# Altium project LeggedBot.PrjPcb
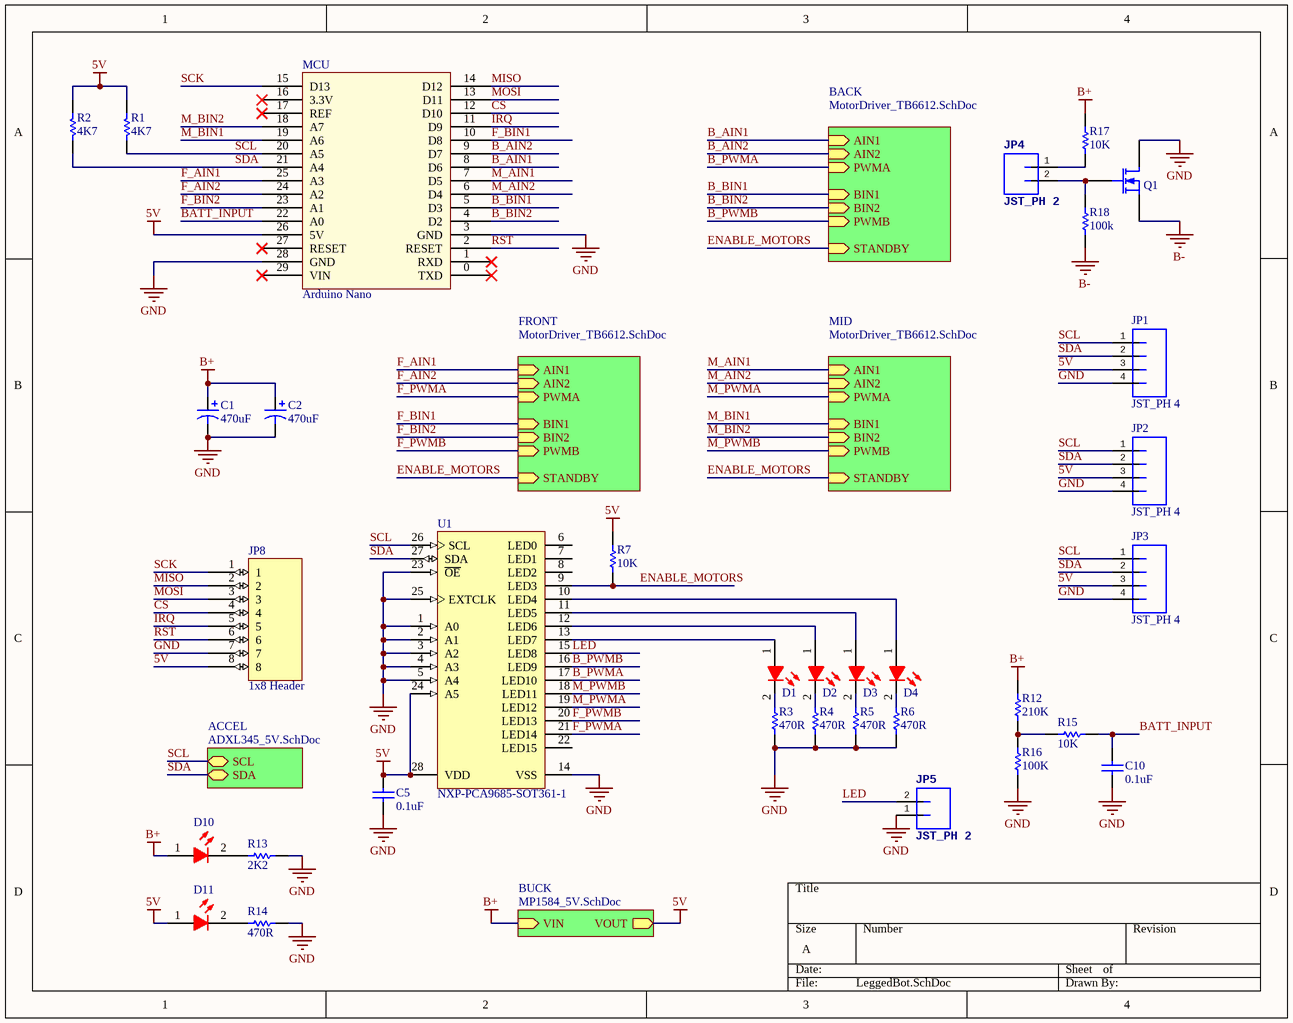
[diagram p0: LeggedBot.SchDoc]
5 sheets, 70 parts. Net scope: hierarchical (ports join the sheet entries above them; power ports are global).
Board file: LeggedBot.PcbDoc
Sheets:
  LeggedBot.SchDoc
    FRONT = MotorDriver_TB6612.SchDoc
    MID = MotorDriver_TB6612.SchDoc
    BACK = MotorDriver_TB6612.SchDoc
    BUCK = MP1584_5V.SchDoc
    ACCEL = ADXL345_5V.SchDoc
      LLS = I2CShifter.SchDoc

## Sheet LeggedBot.SchDoc
size A

### Parts
C1  470uF  [CAP_10mm]
C2  470uF  [CAP_10mm]
C5  0.1uF  [CAPC0603(1608)100_L]
C10  0.1uF  [CAPC0603(1608)100_L]
D1  TLSU1008A(T04)  [TOSH-0603LED_RED_V]  (value not drawn)
D2  TLSU1008A(T04)  [TOSH-0603LED_RED_V]  (value not drawn)
D3  TLSU1008A(T04)  [TOSH-0603LED_RED_V]  (value not drawn)
D4  TLSU1008A(T04)  [TOSH-0603LED_RED_V]  (value not drawn)
D10  TLSU1008A(T04)  [TOSH-0603LED_RED_V]  (value not drawn)
D11  TLSU1008A(T04)  [TOSH-0603LED_RED_V]  (value not drawn)
JP1  JST_PH 4  [JST-4-PTH-VERT]
JP2  JST_PH 4  [JST-4-PTH-VERT]
JP3  JST_PH 4  [JST-4-PTH-VERT]
JP4  JST_PH 2  [JST-2-PTH-VERT]
JP5  JST_PH 2  [JST-2-PTH-VERT]
JP8  1x8 Header  [Header 8x1 8.5mm]
MCU  Arduino Nano  [Arduino Nano]
Q1  MOSFET-N  [SOIC127P600X175-8N]  (value not drawn)
R1  4K7  [RESC0603(1608)_L]
R2  4K7  [RESC0603(1608)_L]
R3  470R  [RESC0603(1608)_L]
R4  470R  [RESC0603(1608)_L]
R5  470R  [RESC0603(1608)_L]
R6  470R  [RESC0603(1608)_L]
R7  10K  [RESC0603(1608)_L]
R12  210K  [RESC0603(1608)_L]
R13  2K2  [RESC0603(1608)_L]
R14  470R  [RESC0603(1608)_L]
R15  10K  [RESC0603(1608)_L]
R16  100K  [RESC0603(1608)_L]
R17  10K  [RESC0603(1608)_L]
R18  100k  [RESC0603(1608)_L]
U1  NXP-PCA9685-SOT361-1  [TSSOP-28]

### Sub-sheets
ACCEL = ADXL345_5V.SchDoc: SDA, SCL (bidir)
BACK = MotorDriver_TB6612.SchDoc: AIN2 (in), PWMA (in), AIN1 (in), BIN1 (in), BIN2 (in), PWMB (in), STANDBY (in)
BUCK = MP1584_5V.SchDoc: VIN (in), VOUT (out)
FRONT = MotorDriver_TB6612.SchDoc: AIN2 (in), PWMA (in), AIN1 (in), BIN1 (in), BIN2 (in), PWMB (in), STANDBY (in)
MID = MotorDriver_TB6612.SchDoc: AIN2 (in), PWMA (in), AIN1 (in), BIN1 (in), BIN2 (in), PWMB (in), STANDBY (in)

### Nets
5V: C5.2 D11.1(A) JP1.3 JP2.3 JP3.3 JP8.8 MCU.26(5V) R1.2 R2.2 R7.2 U1.24(A5) U1.28(VDD) ; sheet BUCK/VOUT
B+: C1.0 C2.0 D10.1(A) R12.2 R17.2 ; sheet BUCK/VIN
B-: Q1.3(S) R18.1
GND: C1.1 C2.1 C5.1 C10.1 JP1.4 JP2.4 JP3.4 JP5.1 JP8.7 MCU.3(GND) MCU.28(GND) Q1.2(D) R3.1 R4.1 R5.1 R6.1 R13.2 R14.1 R16.1 U1.1(A0) U1.2(A1) U1.3(A2) U1.4(A3) U1.5(A4) U1.14(VSS) U1.23(~{OE}) U1.25(EXTCLK)
B_AIN1: MCU.8(D6) ; sheet BACK/AIN1
B_AIN2: MCU.9(D7) ; sheet BACK/AIN2
B_BIN1: MCU.5(D3) ; sheet BACK/BIN1
B_BIN2: MCU.4(D2) ; sheet BACK/BIN2
B_PWMA: U1.17(LED10) ; sheet BACK/PWMA
B_PWMB: U1.16(LED9) ; sheet BACK/PWMB
BATT_INPUT: C10.2 MCU.22(A0) R15.1
CS: JP8.4 MCU.12(D10)
ENABLE_MOTORS: R7.1 U1.9(LED3) ; sheet FRONT/STANDBY, sheet MID/STANDBY, sheet BACK/STANDBY
F_AIN1: MCU.25(A3) ; sheet FRONT/AIN1
F_AIN2: MCU.24(A2) ; sheet FRONT/AIN2
F_BIN1: MCU.10(D8) ; sheet FRONT/BIN1
F_BIN2: MCU.23(A1) ; sheet FRONT/BIN2
F_PWMA: U1.21(LED14) ; sheet FRONT/PWMA
F_PWMB: U1.20(LED13) ; sheet FRONT/PWMB
IRQ: JP8.5 MCU.11(D9)
LED: JP5.2 U1.15(LED8)
M_AIN1: MCU.7(D5) ; sheet MID/AIN1
M_AIN2: MCU.6(D4) ; sheet MID/AIN2
M_BIN1: MCU.19(A6) ; sheet MID/BIN1
M_BIN2: MCU.18(A7) ; sheet MID/BIN2
M_PWMA: U1.19(LED12) ; sheet MID/PWMA
M_PWMB: U1.18(LED11) ; sheet MID/PWMB
MISO: JP8.2 MCU.14(D12)
MOSI: JP8.3 MCU.13(D11)
RST: JP8.6 MCU.2(RESET)
SCK: JP8.1 MCU.15(D13)
SCL: JP1.1 JP2.1 JP3.1 MCU.20(A5) R1.1 U1.26(SCL) ; sheet ACCEL/SCL
SDA: JP1.2 JP2.2 JP3.2 MCU.21(A4) R2.1 U1.27(SDA) ; sheet ACCEL/SDA
NetD1_1: D1.1(A) U1.13(LED7)
NetD1_2: D1.2(K) R3.2
NetD2_1: D2.1(A) U1.12(LED6)
NetD2_2: D2.2(K) R4.2
NetD3_1: D3.1(A) U1.11(LED5)
NetD3_2: D3.2(K) R5.2
NetD4_1: D4.1(A) U1.10(LED4)
NetD4_2: D4.2(K) R6.2
NetD10_2: D10.2(K) R13.1
NetD11_2: D11.2(K) R14.2
NetJP4_1: JP4.1 R17.1
NetJP4_2: JP4.2 Q1.1(G) R18.2
NetR12_1: R12.1 R15.2 R16.2

Not connected (* = marked no-connect by the designer): MCU 0(TXD)* 1(RXD)* 16(3.3V)* 17(REF)* 27(RESET)* 29(VIN)*; U1 6(LED0) 7(LED1) 8(LED2) 22(LED15)

### Library data of the parts
C1 C2 = CAP_10MM_GENERIC: Generic electrolytic capacitor w/ 10mm diameter and 5mm pitch
C5 C10 = CMP-1035-02591-1: CAP 100nF 50V ±5% 0603 (1608 Metric) Thickness 1mm SMD; Tolerance: Â±5%; Case-Metric: 1608; Case-EIA: 0603; Rated Voltage: 50 V; Max Thickness: 1 mm; Technology: SMT; Value: 100nF
D1-D4 D10 D11 = CMP-0444-00001-1: LED, Red 0603 (1608) 63mCd; Manufacturer: Toshiba; Forward Current: 25 mA; Power Dissipation: 60 mW; Packing Type: Reel; Reverse Voltage: 4 V; Mounting Technology: Surface Mount; PackageDescription: 2-Pin SMT LED, 1.6 x 0.8 mm Pitch; ComponentLink1URL: http://www.toshiba-components.com/; ComponentLink1Description: Manufacturer URL; PackageReference: 0603LED_RED; PartNumber: TLSU1008A(T04); ComponentLink2URL: http://www.semicon.toshiba.co.jp/info/docget.jsp?type=datasheet&lang=en&pid=TLSU1008A(T04); ComponentLink2Description: Datasheet; DatasheetVersion: Aug-08; Storage Temperature: -40 to 100 degC
Q1 = MOSFET-N: N-Channel MOSFET; pin to pad: 1>2 2>3 3>1; Published: 8-Jun-2000; LatestRevisionDate: 17-Jul-2002; LatestRevisionNote: Re-released for DXP Platform.; PackageVersion: 1995/1996; PackageReference: E3; Publisher: Altium Limited; PackageDescription: TO, Flat Index; 3 In-Line, Axial Leads; Body Dia. 4.6mm; Lead Dia. 0.5 mm (max)
R1 R2 = CMP-1012-00090-1: 4K7 0.1W 5% 0603 (1608 Metric)  SMD; Case-Metric: 1608; Value: 4700.00 Ohm; Case-EIA: 0603; Tolerance: 5 %; Technology: SMT; Power: 0.1 W
R3-R6 R14 = CMP-1012-00066-1: 470R 0.1W 5% 0603 (1608 Metric)  SMD; Case-Metric: 1608; Case-EIA: 0603; Value: 470.00 Ohm; Tolerance: 5 %; Technology: SMT; Power: 0.1 W
R7 R15 R17 = CMP-1012-00098-1: 10K 0.1W 5% 0603 (1608 Metric)  SMD; Case-EIA: 0603; Value: 10000.00 Ohm; Case-Metric: 1608; Technology: SMT; Tolerance: 5 %; Power: 0.1 W
R12 = CMP-1012-00770-1: 210K 0.1W 1% 0603 (1608 Metric)  SMD; Case-Metric: 1608; Value: 210000.00 Ohm; Case-EIA: 0603; Technology: SMT; Power: 0.1 W; Tolerance: 1 %
R13 = CMP-1012-00082-1: 2K2 0.1W 5% 0603 (1608 Metric)  SMD; Case-Metric: 1608; Value: 2200.00 Ohm; Case-EIA: 0603; Power: 0.1 W; Tolerance: 5 %; Technology: SMT
R16 R18 = CMP-1012-00736-1: 100K 0.1W 1% 0603 (1608 Metric)  SMD; Value: 100000.00 Ohm; Case-Metric: 1608; Case-EIA: 0603; Power: 0.1 W; Tolerance: 1 %; Technology: SMT
JP8 = 1x8 Header: Supplier 1: Arrow; Supplier 2: Arrow; Supplier 3: Digi-Key

## Sheet MotorDriver_TB6612.SchDoc
size A
Used 3 times, as channels FRONT, MID, BACK. Parts and nets are listed once, with the designators drawn on the sheet.
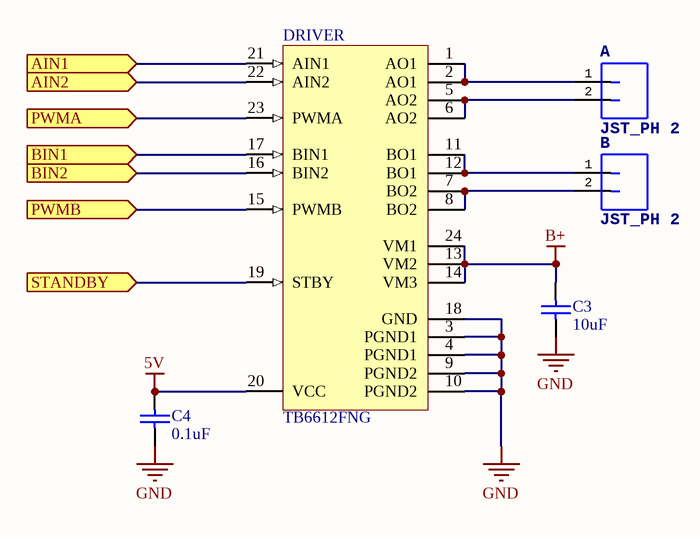
[diagram p1: MotorDriver_TB6612.SchDoc]

### Parts
A  JST_PH 2  [JST-2-PTH-VERT]
B  JST_PH 2  [JST-2-PTH-VERT]
C3  10uF  [CAPC1210(3225)155_N]
C4  0.1uF  [CAPC0603(1608)100_L]
DRIVER  TB6612FNG  [TOSH-SSOP-24_M]

### Ports
AIN1 (in), AIN2 (in), BIN1 (in), BIN2 (in), PWMA (in), PWMB (in), STANDBY (in)

### Nets
5V: C4.2 DRIVER.20(VCC)
B+: C3.2 DRIVER.13(VM2) DRIVER.14(VM3) DRIVER.24(VM1)
GND: C3.1 C4.1 DRIVER.3(PGND1) DRIVER.4(PGND1) DRIVER.9(PGND2) DRIVER.10(PGND2) DRIVER.18(GND)
AIN1: DRIVER.21(AIN1) ; port AIN1
AIN2: DRIVER.22(AIN2) ; port AIN2
BIN1: DRIVER.17(BIN1) ; port BIN1
BIN2: DRIVER.16(BIN2) ; port BIN2
PWMA: DRIVER.23(PWMA) ; port PWMA
PWMB: DRIVER.15(PWMB) ; port PWMB
STANDBY: DRIVER.19(STBY) ; port STANDBY
NetA_1: A.1 DRIVER.1(AO1) DRIVER.2(AO1)
NetA_2: A.2 DRIVER.5(AO2) DRIVER.6(AO2)
NetB_1: B.1 DRIVER.11(BO1) DRIVER.12(BO1)
NetB_2: B.2 DRIVER.7(BO2) DRIVER.8(BO2)

### Channels
FRONT: designators end in _FRONT; ports AIN1=F_AIN1 AIN2=F_AIN2 BIN1=F_BIN1 BIN2=F_BIN2 PWMA=F_PWMA PWMB=F_PWMB STANDBY=ENABLE_MOTORS
MID: designators end in _MID; ports AIN1=M_AIN1 AIN2=M_AIN2 BIN1=M_BIN1 BIN2=M_BIN2 PWMA=M_PWMA PWMB=M_PWMB STANDBY=ENABLE_MOTORS
BACK: designators end in _BACK; ports AIN1=B_AIN1 AIN2=B_AIN2 BIN1=B_BIN1 BIN2=B_BIN2 PWMA=B_PWMA PWMB=B_PWMB STANDBY=ENABLE_MOTORS

### Library data of the parts
C3 = CMP-1038-02231-1: CAP 10uF 25V -20% to +80% 1210 (3225 Metric) Thickness 1.45mm SMD; Case-Metric: 3225; Case-EIA: 1210; Technology: SMT; Value: 10uF; Rated Voltage: 25 V; Max Thickness: 1.45 mm; Tolerance: -20% to +80%
C4 = CMP-1035-02591-1: as C5 on sheet LeggedBot; Rated Voltage: 50 V; Max Thickness: 1 mm; Technology: SMT; Value: 100nF
DRIVER = CMP-1773-00001-1: Driver IC for Dual DC Motor, 15 V, -20 to 85 degC, 24-Pin SSOP, RoHS, Tape and Reel; Elements: 2; Max Power Dissipation: 200 mW; Max Surge Current: 100 mA; Element Configuration: Common Cathode; Case\Package: TO-236-3; Forward Voltage: 1 V; Peak Reverse Current: 0.1 uA; Forward Current: 70 mA; Recovery Time: 5 ns; Radiation Hardening: No; Packaging: Tape and Reel; ComponentLink2Description: Datasheet; REACH SVHC: No SVHC; ComponentLink2URL: https://toshiba.semicon-storage.com/info/docget.jsp?did=10660&prodName=TB6612FNG; RoHSCompliant: true; DatasheetVersion: Oct-14; PackageDescription: 24-Pin Shrink Small Outline Package Integrated Circuit, Body 7.8 x 5.6 mm, Pitch 0.65 mm; Package Quantity: 3000; Length: 3 mm; Pins: 3; Mount: Surface Mount; ComponentLink1Description: Manufacturer URL; PackageReference: SSOP-24; ComponentLink1URL: http://www.toshiba.com/; Width: 1.4 mm; Max Operating Temperature: 125 degC; Height: 1.1 mm; Min Operating Temperature: -55 degC

## Sheet MP1584_5V.SchDoc
size A
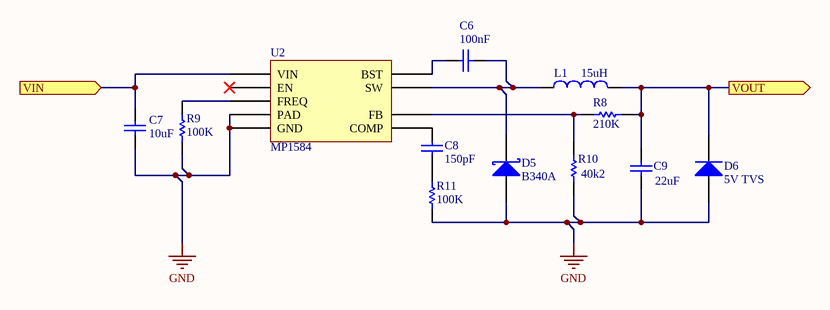
[diagram p2: MP1584_5V.SchDoc]

### Parts
C6  100nF  [CAPC0603(1608)100_L]
C7  10uF  [CAPC1210(3225)280_L]
C8  150pF  [CAPC0603(1608)100_L]
C9  22uF  [CAPC1210(3225)170_L]
D5  B340A  [DIOD-SMA-2_V]
D6  5V TVS  [VISH-DO-214AC-2_L]
L1  value 15uH  [0630 Inductor]  (hidden comment: 0630 Inductor)
R8  210K  [RESC0603(1608)_L]
R9  100K  [RESC0603(1608)_L]
R10  40k2  [RESC0603(1608)_L]
R11  100K  [RESC0603(1608)_L]
U2  MP1584  [SOIC8E]

### Ports
VIN (in), VOUT (out)

### Nets
5V: C9.2 D6.1(K) L1.2 R8.2 ; port VOUT
B+: C7.2 U2.7(VIN) ; port VIN
GND: C7.1 C9.1 D5.1(A) D6.2(A) R9.1 R10.1 R11.1 U2.5(GND) U2.9(PAD)
NetC6_1: C6.1 U2.8(BST)
NetC6_2: C6.2 D5.2(K) L1.1 U2.1(SW)
NetC8_1: C8.1 R11.2
NetC8_2: C8.2 U2.3(COMP)
NetR8_1: R8.1 R10.2 U2.4(FB)
NetR9_2: R9.2 U2.6(FREQ)

Not connected (* = marked no-connect by the designer): U2 2(EN)*

### Library data of the parts
C6 = CMP-1035-02591-1: as C5 on sheet LeggedBot; Rated Voltage: 50 V; Max Thickness: 1 mm; Technology: SMT; Value: 100nF
C7 = CMP-1038-02234-1: CAP 10uF 35V ±10% 1210 (3225 Metric) Thickness 2.8mm SMD; Case-Metric: 3225; Case-EIA: 1210; Tolerance: Â±10%; Rated Voltage: 35 V; Value: 10uF; Max Thickness: 2.8 mm; Technology: SMT
C8 = CMP-1035-01367-1: CAP 150pF 50V ±5% 0603 (1608 Metric) Thickness 1mm SMD; Case-Metric: 1608; Tolerance: Â±5%; Case-EIA: 0603; Technology: SMT; Rated Voltage: 50 V; Value: 150pF; Max Thickness: 1 mm
C9 = CMP-1038-02258-1: CAP 22uF 6.3V ±10% 1210 (3225 Metric) Thickness 1.7mm SMD; Case-Metric: 3225; Tolerance: Â±10%; Case-EIA: 1210; Value: 22uF; Rated Voltage: 6.3 V; Technology: SMT; Max Thickness: 1.7 mm
D5 = CMP-1667-00003-1: Surface Mount Schottky Barrier Rectifier, 40 V, 3 A, -55 to 150 degC, 2-Pin SMA, RoHS, Tape and Reel; Forward Current: 3 A; Forward Voltage: 500 mV; Max Surge Current: 80 A; Peak Reverse Current: 500 uA; Elements: 1; Mounting Technology: Surface Mount; ComponentLink1URL: http://www.diodes.com/; PackageDescription: 2-Pin Surface Mounted Assembly, Body 4.3 x 2.605 mm, Height 2.4 mm; Min Operating Temperature: -55 degC; Mount: Surface Mount; Pins: 2; ComponentLink2URL: http://www.diodes.com/_files/datasheets/ds30891.pdf; PackageReference: SMA-2; Max Operating Temperature: 125 degC; Radiation Hardening: No; Length: 4.6 mm; RoHSCompliant: true; ComponentLink1Description: Manufacturer URL; Height: 2.1 mm; ComponentLink2Description: Datasheet; Packaging: Tape and Reel; Package Quantity: 5000; Case\Package: SMA; DatasheetVersion: Rev. 17 - 2, 09/2015; REACH SVHC: No SVHC; Width: 2.92 mm
D6 = CMP-0548-00062-2: Transient Voltage Suppressor, 6.40 to 231 V, 5 V Stand-off Voltage, Uni-Directional, -55 to 155 degC, 2-pin DO-214AC, Pb-Free, Tape and Reel; Manufacturer: Vishay Semiconductor; PartNumber: SMAJ5.0AHE3/61; ID (uA): 800; VBR Uni-Directional (V): 6.4 to 231; IFSM: 40 A; VWM (V): 5; PPPM (W): 400, 300; DatasheetVersion: 12/8/2013; ComponentLink3URL: http://www.vishay.com/docs/88390/smaj50a.pdf; ComponentLink2URL: http://www.vishay.com/docs/88390/smaj50a.pdf; PackageDescription: 2-Pin DO-214AC (SMA), Body 4.245 x 2.665 mm; ComponentLink3Description: Package Specification; RoHS: TRUE; Operating Junction and Storage Temperature Range: -55 to 150 degC; ComponentLink2Description: Datasheet; Mounting Technology: Surface Mount; Packing: Tape and Reel; PackageReference: DO-214AC-2; ComponentLink1Description: Manufacturer URL; ComponentLink1URL: http://www.vishay.com/
L1 = PCC-M0630M: Code_IEC: 1005; Published: 8-Jun-2000; LatestRevisionDate: 29-May-2009; LatestRevisionNote: IPC-7351 Footprint Added.; PackageReference: 0402-A; Publisher: Altium Limited; PackageDescription: Chip Inductor; Code_JEITA: 0402
R8 = CMP-1012-00770-1: as R12 on sheet LeggedBot; Technology: SMT; Power: 0.1 W; Tolerance: 1 %
R9 R11 = CMP-1012-00122-1: 100K 0.1W 5% 0603 (1608 Metric)  SMD; Case-EIA: 0603; Value: 100000.00 Ohm; Case-Metric: 1608; Tolerance: 5 %; Power: 0.1 W; Technology: SMT
R10 = CMP-1012-00691-1: 40K2 0.1W 1% 0603 (1608 Metric)  SMD; Case-Metric: 1608; Value: 40200.00 Ohm; Case-EIA: 0603; Tolerance: 1 %; Technology: SMT; Power: 0.1 W
U2 = MP1584: MP1584 3A, 1.5MHz, 28V Step-Down Converter

## Sheet ADXL345_5V.SchDoc
size A
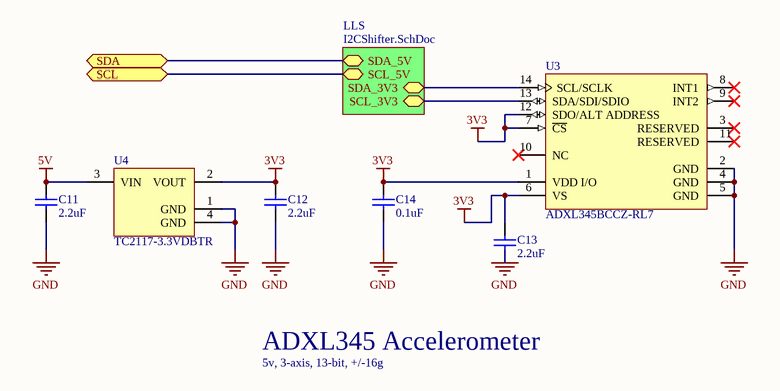
[diagram p3: ADXL345_5V.SchDoc]

### Parts
C11  2.2uF  [CAPC0603(1608)100_L]
C12  2.2uF  [CAPC0603(1608)100_L]
C13  2.2uF  [CAPC0603(1608)100_L]
C14  0.1uF  [CAPC0603(1608)100_L]
U3  ADXL345BCCZ-RL7  [ADI-CC-14-1_V]
U4  TC2117-3.3VDBTR  [SOT-223-DB3_L]

### Sub-sheets
LLS = I2CShifter.SchDoc: SDA_3V3 (bidir), SCL_3V3 (bidir), SDA_5V (bidir), SCL_5V (bidir)

### Ports
SCL (bidir), SDA

### Nets
3V3: C12.2 C13.2 C14.2 U3.1(VDD_I/O) U3.6(VS) U3.7(~{CS}) U3.12(SDO/ALT_ADDRESS) U4.2(VOUT)
5V: C11.2 U4.3(VIN)
GND: C11.1 C12.1 C13.1 C14.1 U3.2(GND) U3.4(GND) U3.5(GND) U4.1(GND) U4.4(GND)
SCL: port SCL, sheet LLS/SCL_5V
SDA: port SDA, sheet LLS/SDA_5V
NetQ2_2: U3.14(SCL/SCLK) ; sheet LLS/SDA_3V3
NetQ3_2: U3.13(SDA/SDI/SDIO) ; sheet LLS/SCL_3V3

Not connected (* = marked no-connect by the designer): U3 3(RESERVED)* 8(INT1)* 9(INT2)* 10(NC)* 11(RESERVED)*

### Notes on the sheet
- ADXL345 Accelerometer
- 5v, 3-axis, 13-bit, +/-16g

### Library data of the parts
C11-C13 = CMP-1035-02767-1: CAP 2.2uF 25V ±10% 0603 (1608 Metric) Thickness 1mm SMD; Case-EIA: 0603; Tolerance: Â±10%; Case-Metric: 1608; Technology: SMT; Value: 2.2uF; Max Thickness: 1 mm; Rated Voltage: 25 V
C14 = CMP-1035-02591-1: as C5 on sheet LeggedBot; Rated Voltage: 50 V; Max Thickness: 1 mm; Technology: SMT; Value: 100nF
U3 = CMP-0885-00033-1: 3-Axis, +/-2 g / +/-4 g / +/-8 g / +/-16 g Digital Accelerometer with Digital Output, 1.6 KHz BW, Industrial, 14-pin LGA, Reel; Manufacturer: Analog Devices; Supply Current: 140 uA; Voltage Supply (V): 2.0 to 3.6; -3dB Bandwidth: 1.6 KHz; Sensitivity: 256/128/64/32 LSB/g; # of Axes: 3; Output Type: Digital; PackageDescription: 14-Pin Land Grid Array, 3 x 5 mm Body, 0.8 mm Pitch; ComponentLink1URL: http://www.analog.com/en/index.html; ComponentLink2Description: Datasheet; PartNumber: ADXL345BCCZ-RL7; ComponentLink3Description: Package Specification; ComponentLink4URL: http://www.analog.com/en/mems-sensors/mems-inertial-sensors/adxl345/products/product.html; PackageVersion: 03-16-2010-A, 03/2010; ComponentLink1Description: Manufacturer URL; ComponentLink2URL: http://www.analog.com/static/imported-files/data_sheets/ADXL345.pdf; DatasheetVersion: Rev. D; PackageReference: CC-14-1; Packing: Reel; Mounting Technology: Surface Mount; ComponentLink4Description: Product URL; ComponentLink3URL: http://www.analog.com/static/imported-files/data_sheets/ADXL343.pdf
U4 = CMP-0136-00509-1: 800 mA Fixed Low Dropout Positive Regulator, 3-Pin SOT-223, Extended Temperature, Tape and Reel; PackageVersion: revBB, Aug-2009; DatasheetVersion: revC, Oct-2006; PackageReference: SOT-223-DB3; PackageDescription: 3-Lead Plastic Small Outline Transistor (DB) [SOT-223]

## Sheet I2CShifter.SchDoc
size A
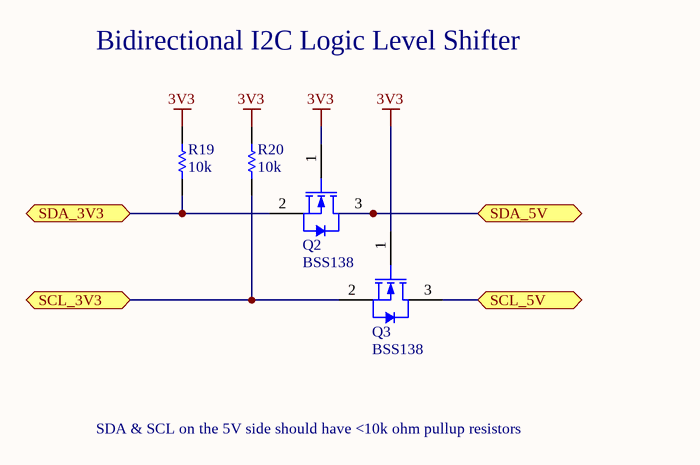
[diagram p4: I2CShifter.SchDoc]

### Parts
Q2  BSS138  [FAIR-SOT23-3_V]
Q3  BSS138  [FAIR-SOT23-3_V]
R19  10k  [RESC0603(1608)_L]
R20  10k  [RESC0603(1608)_L]

### Ports
SCL_3V3 (bidir), SCL_5V (bidir), SDA_3V3 (bidir), SDA_5V (bidir)

### Nets
3V3: Q2.1(G) Q3.1(G) R19.2 R20.2
SCL: Q3.3(D) ; port SCL_5V
SDA: Q2.3(D) ; port SDA_5V
NetQ2_2: Q2.2(S) R19.1 ; port SDA_3V3
NetQ3_2: Q3.2(S) R20.1 ; port SCL_3V3

### Notes on the sheet
- Bidirectional I2C Logic Level Shifter
- SDA & SCL on the 5V side should have <10k ohm pullup resistors

### Library data of the parts
Q2 Q3 = CMP-1670-00009-1: N-Channel Logic Level Enhancement Mode Field Effect Transistor, 220 mA, 50 V, -55 to 150 degC, 3-Pin SOT-23, RoHS, Tape and Reel; ESR: 40 Ohm; Tolerance: 30ppm; Capacitance: 1.8E-11 f; Load Capacitance: 18 pF; Frequency: 12 MHz; Resistance: 100 Ohm; Min Operating Temperature: -20degC; ComponentLink2URL: https://www.fairchildsemi.com/datasheets/BS/BSS138.pdf; Max Operating Temperature: 70degC; Width: 0.126 inch; Pins: 4; Length: 0.197 inch; ComponentLink2Description: Datasheet; Package Quantity: 1; PackageReference: SOT23-3; Packaging: Tape and Reel; RoHSCompliant: True; Frequency Tolerance: 30ppm; ComponentLink3Description: Package Specification; Mount: Surface Mount; REACH SVHC: Unknown; Height: 0.041 inch; ComponentLink1URL: https://www.fairchildsemi.com/; PackageDescription: 3-Pin Small Outline Transistor, Body 2.92 x 1.325 mm, Pitch 0.95 mm; ComponentLink3URL: http://www.fairchildsemi.com/dwg/MA/MA03D.pdf; ComponentLink1Description: Manufacturer URL; DatasheetVersion: Rev. C, 10/2005
R19 R20 = CMP-1012-00098-1: as R7 on sheet LeggedBot; Technology: SMT; Tolerance: 5 %; Power: 0.1 W

## Nets that join several sheets
3V3: ADXL345_5V (8 pins), I2CShifter (Q2.1 Q3.1 R19.2 R20.2)
5V: LeggedBot (12 pins), FRONT (C4_FRONT.2 DRIVER_FRONT.20), MID (C4_MID.2 DRIVER_MID.20), BACK (C4_BACK.2 DRIVER_BACK.20), MP1584_5V (C9.2 D6.1 L1.2 R8.2), ADXL345_5V (C11.2 U4.3)
B+: LeggedBot (5 pins), FRONT (C3_FRONT.2 DRIVER_FRONT.13 DRIVER_FRONT.14 DRIVER_FRONT.24), MID (C3_MID.2 DRIVER_MID.13 DRIVER_MID.14 DRIVER_MID.24), BACK (C3_BACK.2 DRIVER_BACK.13 DRIVER_BACK.14 DRIVER_BACK.24), MP1584_5V (C7.2 U2.7)
GND: LeggedBot (27 pins), FRONT (7 pins), MID (7 pins), BACK (7 pins), MP1584_5V (9 pins), ADXL345_5V (9 pins)
B_AIN1: LeggedBot (MCU.8), BACK (DRIVER_BACK.21)
B_AIN2: LeggedBot (MCU.9), BACK (DRIVER_BACK.22)
B_BIN1: LeggedBot (MCU.5), BACK (DRIVER_BACK.17)
B_BIN2: LeggedBot (MCU.4), BACK (DRIVER_BACK.16)
B_PWMA: LeggedBot (U1.17), BACK (DRIVER_BACK.23)
B_PWMB: LeggedBot (U1.16), BACK (DRIVER_BACK.15)
ENABLE_MOTORS: LeggedBot (R7.1 U1.9), FRONT (DRIVER_FRONT.19), MID (DRIVER_MID.19), BACK (DRIVER_BACK.19)
F_AIN1: LeggedBot (MCU.25), FRONT (DRIVER_FRONT.21)
F_AIN2: LeggedBot (MCU.24), FRONT (DRIVER_FRONT.22)
F_BIN1: LeggedBot (MCU.10), FRONT (DRIVER_FRONT.17)
F_BIN2: LeggedBot (MCU.23), FRONT (DRIVER_FRONT.16)
F_PWMA: LeggedBot (U1.21), FRONT (DRIVER_FRONT.23)
F_PWMB: LeggedBot (U1.20), FRONT (DRIVER_FRONT.15)
M_AIN1: LeggedBot (MCU.7), MID (DRIVER_MID.21)
M_AIN2: LeggedBot (MCU.6), MID (DRIVER_MID.22)
M_BIN1: LeggedBot (MCU.19), MID (DRIVER_MID.17)
M_BIN2: LeggedBot (MCU.18), MID (DRIVER_MID.16)
M_PWMA: LeggedBot (U1.19), MID (DRIVER_MID.23)
M_PWMB: LeggedBot (U1.18), MID (DRIVER_MID.15)
NetQ2_2: ADXL345_5V (U3.14), I2CShifter (Q2.2 R19.1)
NetQ3_2: ADXL345_5V (U3.13), I2CShifter (Q3.2 R20.1)
SCL: LeggedBot (6 pins), I2CShifter (Q3.3)
SDA: LeggedBot (6 pins), I2CShifter (Q2.3)